# Altium schematic sheet 39. CSI MUX.SchDoc: CSI MUX - DATA
size 513 x 386 mm; Project: PROC154E2(001)_SK_AM69; Issue: 1.0; RevCode: E3; Page Create Date: March  8, 1995; Variant Name: Core Design; Schematic Page Number: 39; Page Number: 39; Page Size: C; Comment: MISTRAL_TITLEBLK_CSIZE_1; Page Count: 62; Schematic Page Count: 62; Name: PROC154E2 001 SK AM69; DsnPath: C:\Users\danie\Downloads\sprr466c\PROC154E3_RP\PROC154E3_SCH.DSN; SchematicName: SCHEMATIC1; PageName: 39. CSI MUX; PageSize: C; TopSchematic: True
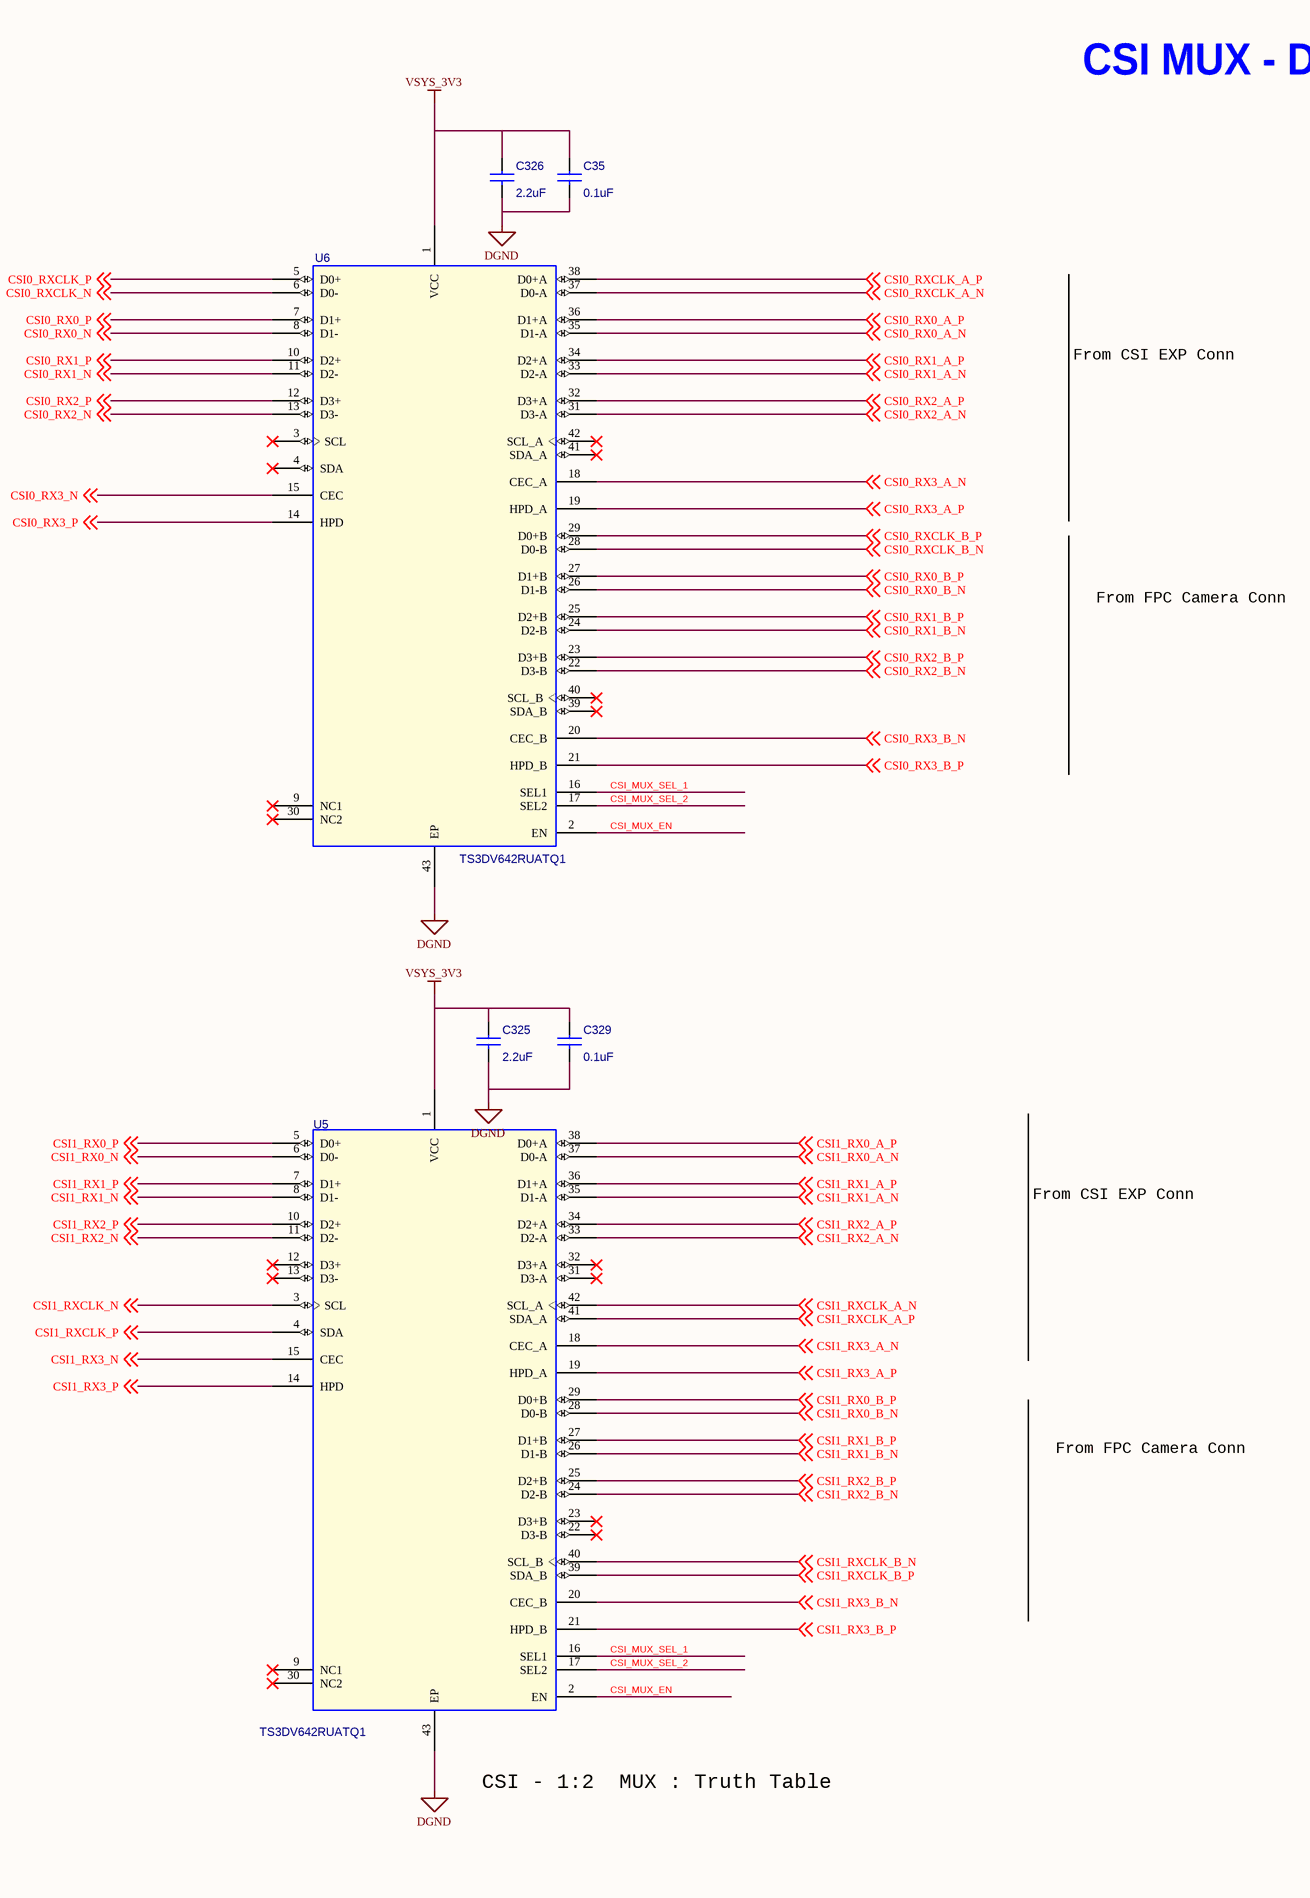
[diagram p0: 39. CSI MUX.SchDoc, left]
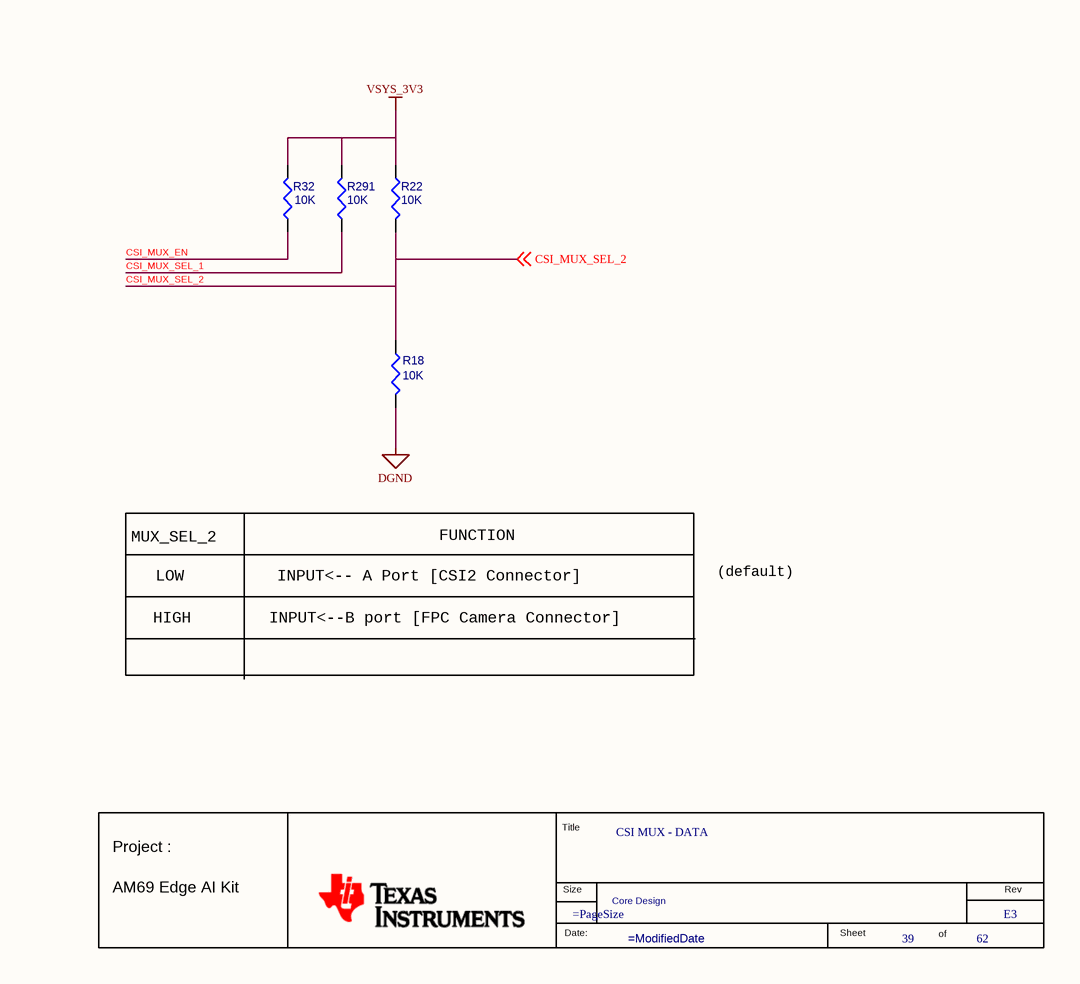
[diagram p1: 39. CSI MUX.SchDoc, right]

## Parts
*  RevCode: E3  Title: CSI MUX - DATA  Page Number: 39  Page Count: 62  Variant Name: Core Design  (hidden comment: MISTRAL_TITLEBLK_CSIZE_1)  (graphical)
C35  0.1uF  [CAP0201_0-5]
C325  2.2uF  [CAP0603_1]
C326  2.2uF  [CAP0603_1]
C329  0.1uF  [CAP0201_0-5]
R18  10K  [RES0201_0-5]
R22  10K  [RES0201_0-5]
R32  10K  [RES0201_0-5]
R291  10K  [RES0201_0-5]
U5  TS3DV642RUATQ1  [TQFN42_19-68_140X360_0-8]
U6  TS3DV642RUATQ1  [TQFN42_19-68_140X360_0-8]

## Nets
DGND: C35.2 C325.2 C326.2 C329.2 R18.2 U5.43(EP) U6.43(EP)
VSYS_3V3: C35.1 C325.1 C326.1 C329.1 R22.1 R32.2 R291.2 U5.1(VCC) U6.1(VCC)
CSI0_RX0_A_N: U6.35(D1-A) ; off-sheet CSI0_RX0_A_N
CSI0_RX0_A_P: U6.36(D1+A) ; off-sheet CSI0_RX0_A_P
CSI0_RX0_B_N: U6.26(D1-B) ; off-sheet CSI0_RX0_B_N
CSI0_RX0_B_P: U6.27(D1+B) ; off-sheet CSI0_RX0_B_P
CSI0_RX0_N: U6.8(D1-) ; off-sheet CSI0_RX0_N
CSI0_RX0_P: U6.7(D1+) ; off-sheet CSI0_RX0_P
CSI0_RX1_A_N: U6.33(D2-A) ; off-sheet CSI0_RX1_A_N
CSI0_RX1_A_P: U6.34(D2+A) ; off-sheet CSI0_RX1_A_P
CSI0_RX1_B_N: U6.24(D2-B) ; off-sheet CSI0_RX1_B_N
CSI0_RX1_B_P: U6.25(D2+B) ; off-sheet CSI0_RX1_B_P
CSI0_RX1_N: U6.11(D2-) ; off-sheet CSI0_RX1_N
CSI0_RX1_P: U6.10(D2+) ; off-sheet CSI0_RX1_P
CSI0_RX2_A_N: U6.31(D3-A) ; off-sheet CSI0_RX2_A_N
CSI0_RX2_A_P: U6.32(D3+A) ; off-sheet CSI0_RX2_A_P
CSI0_RX2_B_N: U6.22(D3-B) ; off-sheet CSI0_RX2_B_N
CSI0_RX2_B_P: U6.23(D3+B) ; off-sheet CSI0_RX2_B_P
CSI0_RX2_N: U6.13(D3-) ; off-sheet CSI0_RX2_N
CSI0_RX2_P: U6.12(D3+) ; off-sheet CSI0_RX2_P
CSI0_RX3_A_N: U6.18(CEC_A) ; off-sheet CSI0_RX3_A_N
CSI0_RX3_A_P: U6.19(HPD_A) ; off-sheet CSI0_RX3_A_P
CSI0_RX3_B_N: U6.20(CEC_B) ; off-sheet CSI0_RX3_B_N
CSI0_RX3_B_P: U6.21(HPD_B) ; off-sheet CSI0_RX3_B_P
CSI0_RX3_N: U6.15(CEC) ; off-sheet CSI0_RX3_N
CSI0_RX3_P: U6.14(HPD) ; off-sheet CSI0_RX3_P
CSI0_RXCLK_A_N: U6.37(D0-A) ; off-sheet CSI0_RXCLK_A_N
CSI0_RXCLK_A_P: U6.38(D0+A) ; off-sheet CSI0_RXCLK_A_P
CSI0_RXCLK_B_N: U6.28(D0-B) ; off-sheet CSI0_RXCLK_B_N
CSI0_RXCLK_B_P: U6.29(D0+B) ; off-sheet CSI0_RXCLK_B_P
CSI0_RXCLK_N: U6.6(D0-) ; off-sheet CSI0_RXCLK_N
CSI0_RXCLK_P: U6.5(D0+) ; off-sheet CSI0_RXCLK_P
CSI1_RX0_A_N: U5.37(D0-A) ; off-sheet CSI1_RX0_A_N
CSI1_RX0_A_P: U5.38(D0+A) ; off-sheet CSI1_RX0_A_P
CSI1_RX0_B_N: U5.28(D0-B) ; off-sheet CSI1_RX0_B_N
CSI1_RX0_B_P: U5.29(D0+B) ; off-sheet CSI1_RX0_B_P
CSI1_RX0_N: U5.6(D0-) ; off-sheet CSI1_RX0_N
CSI1_RX0_P: U5.5(D0+) ; off-sheet CSI1_RX0_P
CSI1_RX1_A_N: U5.35(D1-A) ; off-sheet CSI1_RX1_A_N
CSI1_RX1_A_P: U5.36(D1+A) ; off-sheet CSI1_RX1_A_P
CSI1_RX1_B_N: U5.26(D1-B) ; off-sheet CSI1_RX1_B_N
CSI1_RX1_B_P: U5.27(D1+B) ; off-sheet CSI1_RX1_B_P
CSI1_RX1_N: U5.8(D1-) ; off-sheet CSI1_RX1_N
CSI1_RX1_P: U5.7(D1+) ; off-sheet CSI1_RX1_P
CSI1_RX2_A_N: U5.33(D2-A) ; off-sheet CSI1_RX2_A_N
CSI1_RX2_A_P: U5.34(D2+A) ; off-sheet CSI1_RX2_A_P
CSI1_RX2_B_N: U5.24(D2-B) ; off-sheet CSI1_RX2_B_N
CSI1_RX2_B_P: U5.25(D2+B) ; off-sheet CSI1_RX2_B_P
CSI1_RX2_N: U5.11(D2-) ; off-sheet CSI1_RX2_N
CSI1_RX2_P: U5.10(D2+) ; off-sheet CSI1_RX2_P
CSI1_RX3_A_N: U5.18(CEC_A) ; off-sheet CSI1_RX3_A_N
CSI1_RX3_A_P: U5.19(HPD_A) ; off-sheet CSI1_RX3_A_P
CSI1_RX3_B_N: U5.20(CEC_B) ; off-sheet CSI1_RX3_B_N
CSI1_RX3_B_P: U5.21(HPD_B) ; off-sheet CSI1_RX3_B_P
CSI1_RX3_N: U5.15(CEC) ; off-sheet CSI1_RX3_N
CSI1_RX3_P: U5.14(HPD) ; off-sheet CSI1_RX3_P
CSI1_RXCLK_A_N: U5.42(SCL_A) ; off-sheet CSI1_RXCLK_A_N
CSI1_RXCLK_A_P: U5.41(SDA_A) ; off-sheet CSI1_RXCLK_A_P
CSI1_RXCLK_B_N: U5.40(SCL_B) ; off-sheet CSI1_RXCLK_B_N
CSI1_RXCLK_B_P: U5.39(SDA_B) ; off-sheet CSI1_RXCLK_B_P
CSI1_RXCLK_N: U5.3(SCL) ; off-sheet CSI1_RXCLK_N
CSI1_RXCLK_P: U5.4(SDA) ; off-sheet CSI1_RXCLK_P
CSI_MUX_EN: R32.1 U5.2(EN) U6.2(EN)
CSI_MUX_SEL_1: R291.1 U5.16(SEL1) U6.16(SEL1)
CSI_MUX_SEL_2: R18.1 R22.2 U5.17(SEL2) U6.17(SEL2) ; off-sheet CSI_MUX_SEL_2

Not connected (* = marked no-connect by the designer): U5 9(NC1)* 12(D3+)* 13(D3-)* 22(D3-B)* 23(D3+B)* 30(NC2)* 31(D3-A)* 32(D3+A)*; U6 3(SCL)* 4(SDA)* 9(NC1)* 30(NC2)* 39(SDA_B)* 40(SCL_B)* 41(SDA_A)* 42(SCL_A)*

## Notes on the sheet
- CSI MUX - DATA
- From CSI EXP Conn
- From FPC Camera Conn
- MUX_SEL_2
- LOW
- INPUT<-- A Port [CSI2 Connector]
- FUNCTION
- (default)
- HIGH
- INPUT<--B port [FPC Camera Connector]
- CSI - 1:2  MUX : Truth Table
- (in symbol MISTRAL_TITLEBLK_CSIZE_1) Title; Project :; Size; Rev; AM69 Edge AI Kit; Date:; Sheet; of

## Library data of the parts
* = MISTRAL_TITLEBLK_CSIZE_1: Issue: 1.0; Project: PROC154E2(001)_SK_AM69; Name: PROC154E2 001 SK AM69; Page Create Date: March  8, 1995; Page Size: =PageSize; Page Modify Date: =ModifiedDate; Schematic Page Count: 62; Schematic Page Number: 39
C35 = CAP_Dup1: CAP CERAMIC 0.1uF 16V 10% X7S AUTO 0201; Part Reference: C35; Part_type: CAPACITORS\CERAMIC; Mfr_part_number: GRT033C71C104KE01D; Mfr_name: MURATA; Mistral Part No: 120021030007-R; Custom_Duty: 15%; Customs_HS_Code: 85322990; Wattage: NA; Project: J7ES_SK_BRD; Value: 0.1uF; MECHANICAL 3D STEP FILE: CAP0201_0-5; Chkd/date: MANIRAJA/110321; Crtd /date: ALVY/110321; Datasheet: Y:\MIS_DATABASE\DATASHEETS\CAPACITORS\GRT033C71C104KE01.PDF; Temperature: -55°C+125°C; Weight: 330mg; Height: 0.33MM; Distributor_part_number: 490-GRT033C71C104KE01DTR-ND; Distributor_name: DIGIKEY; Package: 0201; Voltage: 16V; Tolerance: 10%; PCB Footprint: CAP0201_0-5
C325 = CAP_Dup1: CAP CERAMIC 2.2uF 10V 10% X7S 0603; Part Reference: C325; Mistral Part No: 120022090022-R; Mfr_name: MURATA; Mfr_part_number: GCM188C71A225KE01; Part_type: CAPACITORS\CERAMIC; Project: J7AHP_SK_BRD; Wattage: NA; Customs_HS_Code: 85322990; Custom_Duty: 15%; Value: 2.2uF; PCB Footprint: CAP0603_1; Tolerance: 10%; Voltage: 10V; Package: 0603; Distributor_name: NA; Distributor_part_number: NA; Library Ref: CAP; Footprint Ref: CAP0603_1; Height: 0.90MM; Weight: 6.3mg; Temperature: -55°C+125°C; Datasheet: Y:\MIS_DATABASE\DATASHEETS\CAPACITORS\GCM188C71A225KE01.PDF; Crtd /date: PRAVEEN/160922; Chkd/date: PRAVEEN/160922; MECHANICAL 3D STEP FILE: CAP0603_1; Library Path: Y:\MIS_DATABASE\Library\ALTIUM_TOOL\SCHEMATICS_PARTS\MS_DISCRETE_Library.schlib; Footprint Path: Y:\MIS_DATABASE\Library\ALTIUM_TOOL\PCB_FOOTPRINTS\Altium_Footprint_Lib.PcbLib
C326 = CAP_Dup1: CAP CERAMIC 2.2uF 10V 10% X7S 0603; Part Reference: C326; Part_type: CAPACITORS\CERAMIC; Mfr_part_number: GCM188C71A225KE01; Mfr_name: MURATA; Mistral Part No: 120022090022-R; Custom_Duty: 15%; Customs_HS_Code: 85322990; Wattage: NA; Project: J7AHP_SK_BRD; Value: 2.2uF; PCB Footprint: CAP0603_1; Footprint Path: Y:\MIS_DATABASE\Library\ALTIUM_TOOL\PCB_FOOTPRINTS\Altium_Footprint_Lib.PcbLib; Library Path: Y:\MIS_DATABASE\Library\ALTIUM_TOOL\SCHEMATICS_PARTS\MS_DISCRETE_Library.schlib; MECHANICAL 3D STEP FILE: CAP0603_1; Chkd/date: PRAVEEN/160922; Crtd /date: PRAVEEN/160922; Datasheet: Y:\MIS_DATABASE\DATASHEETS\CAPACITORS\GCM188C71A225KE01.PDF; Temperature: -55°C+125°C; Weight: 6.3mg; Height: 0.90MM; Footprint Ref: CAP0603_1; Library Ref: CAP; Distributor_part_number: NA; Distributor_name: NA; Package: 0603; Voltage: 10V; Tolerance: 10%
C329 = CAP_Dup1: CAP CERAMIC 0.1uF 16V 10% X7S AUTO 0201; Part Reference: C329; Part_type: CAPACITORS\CERAMIC; Mfr_part_number: GRT033C71C104KE01D; Mfr_name: MURATA; Mistral Part No: 120021030007-R; Custom_Duty: 15%; Customs_HS_Code: 85322990; Wattage: NA; Project: J7ES_SK_BRD; Value: 0.1uF; MECHANICAL 3D STEP FILE: CAP0201_0-5; Chkd/date: MANIRAJA/110321; Crtd /date: ALVY/110321; Datasheet: Y:\MIS_DATABASE\DATASHEETS\CAPACITORS\GRT033C71C104KE01.PDF; Temperature: -55°C+125°C; Weight: 330mg; Height: 0.33MM; Distributor_part_number: 490-GRT033C71C104KE01DTR-ND; Distributor_name: DIGIKEY; Package: 0201; Voltage: 16V; Tolerance: 10%; PCB Footprint: CAP0201_0-5
R18 = RESISTOR_Dup2: RES 10K 1/20W 5% 0201; Part Reference: R18; Part_type: RESISTORS\FIXED; Mfr_part_number: RC0201JR-0710KL; Mfr_name: YAGEO AMERICA; Mistral Part No: 110010070051-R; Custom_Duty: 15%; Customs_HS_Code: 85332119; Voltage: NA; Project: GOLDEN-I LITE; Value: 10K; Footprint Path: Y:\MIS_DATABASE\Library\ALTIUM_TOOL\PCB_FOOTPRINTS\Altium_Footprint_Lib.PcbLib; Library Path: Y:\MIS_DATABASE\Library\ALTIUM_TOOL\SCHEMATICS_PARTS\MS_DISCRETE_Library.schlib; MECHANICAL 3D STEP FILE: RES0201_0-5; Chkd/date: MANIRAJA/050517; Crtd /date: MANIRAJA/050517; Datasheet: Y:\MIS_DATABASE\DATASHEETS\RESISTORS\RCXXXXL-SER_MAR18.PDF; Temperature: -55°C+125°C; Weight: 0.17mg; Height: 0.26MM; Library Ref: RESISTOR; Distributor_part_number: 311-10KNCT-ND; Distributor_name: DIGIKEY; Package: 0201; Wattage: 1/20W; Tolerance: 5%; Footprint Ref: RES0201_0-5; PCB Footprint: RES0201_0-5
R22 = RESISTOR_Dup2: RES 10K 1/20W 5% 0201; Part Reference: R22; Mistral Part No: 110010070051-R; Mfr_name: YAGEO AMERICA; Mfr_part_number: RC0201JR-0710KL; Part_type: RESISTORS\FIXED; Project: GOLDEN-I LITE; Voltage: NA; Customs_HS_Code: 85332119; Custom_Duty: 15%; Value: 10K; Footprint Ref: RES0201_0-5; Tolerance: 5%; Wattage: 1/20W; Package: 0201; Distributor_name: DIGIKEY; Distributor_part_number: 311-10KNCT-ND; Library Ref: RESISTOR; Height: 0.26MM; Weight: 0.17mg; Temperature: -55°C+125°C; Datasheet: Y:\MIS_DATABASE\DATASHEETS\RESISTORS\RCXXXXL-SER_MAR18.PDF; Crtd /date: MANIRAJA/050517; Chkd/date: MANIRAJA/050517; MECHANICAL 3D STEP FILE: RES0201_0-5; Library Path: Y:\MIS_DATABASE\Library\ALTIUM_TOOL\SCHEMATICS_PARTS\MS_DISCRETE_Library.schlib; Footprint Path: Y:\MIS_DATABASE\Library\ALTIUM_TOOL\PCB_FOOTPRINTS\Altium_Footprint_Lib.PcbLib; PCB Footprint: RES0201_0-5
R32 = RESISTOR_Dup2: RES 10K 1/20W 5% 0201; Part Reference: R32; Part_type: RESISTORS\FIXED; Mfr_part_number: RC0201JR-0710KL; Mfr_name: YAGEO AMERICA; Mistral Part No: 110010070051-R; Custom_Duty: 15%; Customs_HS_Code: 85332119; Voltage: NA; Project: GOLDEN-I LITE; Value: 10K; Footprint Path: Y:\MIS_DATABASE\Library\ALTIUM_TOOL\PCB_FOOTPRINTS\Altium_Footprint_Lib.PcbLib; Library Path: Y:\MIS_DATABASE\Library\ALTIUM_TOOL\SCHEMATICS_PARTS\MS_DISCRETE_Library.schlib; MECHANICAL 3D STEP FILE: RES0201_0-5; Chkd/date: MANIRAJA/050517; Crtd /date: MANIRAJA/050517; Datasheet: Y:\MIS_DATABASE\DATASHEETS\RESISTORS\RCXXXXL-SER_MAR18.PDF; Temperature: -55°C+125°C; Weight: 0.17mg; Height: 0.26MM; Library Ref: RESISTOR; Distributor_part_number: 311-10KNCT-ND; Distributor_name: DIGIKEY; Package: 0201; Wattage: 1/20W; Tolerance: 5%; Footprint Ref: RES0201_0-5; PCB Footprint: RES0201_0-5
R291 = RESISTOR_Dup2: RES 10K 1/20W 5% 0201; Part Reference: R291; Mistral Part No: 110010070051-R; Mfr_name: YAGEO AMERICA; Mfr_part_number: RC0201JR-0710KL; Part_type: RESISTORS\FIXED; Project: GOLDEN-I LITE; Voltage: NA; Customs_HS_Code: 85332119; Custom_Duty: 15%; Value: 10K; Footprint Ref: RES0201_0-5; Tolerance: 5%; Wattage: 1/20W; Package: 0201; Distributor_name: DIGIKEY; Distributor_part_number: 311-10KNCT-ND; Library Ref: RESISTOR; Height: 0.26MM; Weight: 0.17mg; Temperature: -55°C+125°C; Datasheet: Y:\MIS_DATABASE\DATASHEETS\RESISTORS\RCXXXXL-SER_MAR18.PDF; Crtd /date: MANIRAJA/050517; Chkd/date: MANIRAJA/050517; MECHANICAL 3D STEP FILE: RES0201_0-5; Library Path: Y:\MIS_DATABASE\Library\ALTIUM_TOOL\SCHEMATICS_PARTS\MS_DISCRETE_Library.schlib; Footprint Path: Y:\MIS_DATABASE\Library\ALTIUM_TOOL\PCB_FOOTPRINTS\Altium_Footprint_Lib.PcbLib; PCB Footprint: RES0201_0-5
U5 = TS3DV642-Q1_WQFN42: IC 8Gbps 12-CHANNEL DIFFERENTIAL 1:2 AND 2:1 MUX WQFN42; Part Reference: U5; Mistral Part No: 141021020023-R; Mfr_name: TEXAS INSTRUMENTS; Part_type: ICS\DIGITAL\COMBINATIONAL; Project: J7ES_SK_BRD; Tolerance: NA; Customs_HS_Code: 85423100; Custom_Duty: 15%; Value: TS3DV642RUATQ1; PCB Footprint: TQFN42_19-68_140X360_0-8; Footprint Ref: TQFN42_19-68_140X360_0-8; Mfr_part_number: TS3DV642RUATQ1; Voltage: NA; Wattage: NA; Package: WQFN42; Distributor_name: NA; Distributor_part_number: NA; Library Ref: TS3DV642-Q1_WQFN42; Height: 0.80MM; Weight: NA; Temperature: -40°C+105°C; Datasheet: Y:\MIS_DATABASE\DATASHEETS\ICS\DIGITAL\COMBINATIONAL\TS3DV642-Q1.PDF; Crtd /date: ALVY/170221; Chkd/date: MANIRAJA/170221; MECHANICAL 3D STEP FILE: TQFN42_19-68_140X360_0-8; Library Path: Y:\MIS_DATABASE\Library\ALTIUM_TOOL\SCHEMATICS_PARTS\MS_COMBINATIONAL_Library.schlib; Footprint Path: Y:\MIS_DATABASE\Library\ALTIUM_TOOL\PCB_FOOTPRINTS\Altium_Footprint_Lib.PcbLib
U6 = TS3DV642-Q1_WQFN42: IC 8Gbps 12-CHANNEL DIFFERENTIAL 1:2 AND 2:1 MUX WQFN42; Part Reference: U6; Part_type: ICS\DIGITAL\COMBINATIONAL; Mfr_name: TEXAS INSTRUMENTS; Mistral Part No: 141021020023-R; Custom_Duty: 15%; Customs_HS_Code: 85423100; Wattage: NA; Project: J7ES_SK_BRD; Value: TS3DV642RUATQ1; Footprint Path: Y:\MIS_DATABASE\Library\ALTIUM_TOOL\PCB_FOOTPRINTS\Altium_Footprint_Lib.PcbLib; Library Path: Y:\MIS_DATABASE\Library\ALTIUM_TOOL\SCHEMATICS_PARTS\MS_COMBINATIONAL_Library.schlib; MECHANICAL 3D STEP FILE: TQFN42_19-68_140X360_0-8; Chkd/date: MANIRAJA/170221; Crtd /date: ALVY/170221; Datasheet: Y:\MIS_DATABASE\DATASHEETS\ICS\DIGITAL\COMBINATIONAL\TS3DV642-Q1.PDF; Temperature: -40°C+105°C; Weight: NA; Height: 0.80MM; Library Ref: TS3DV642-Q1_WQFN42; Distributor_part_number: NA; Distributor_name: NA; Package: WQFN42; Voltage: NA; Tolerance: NA; Mfr_part_number: TS3DV642RUATQ1; Footprint Ref: TQFN42_19-68_140X360_0-8; PCB Footprint: TQFN42_19-68_140X360_0-8